# EAGLE schematic 10MHzRefOsc_3V0 (EAGLE 7.2.0), part 2 of 2
## Sheet 25 of 28: Socket_5
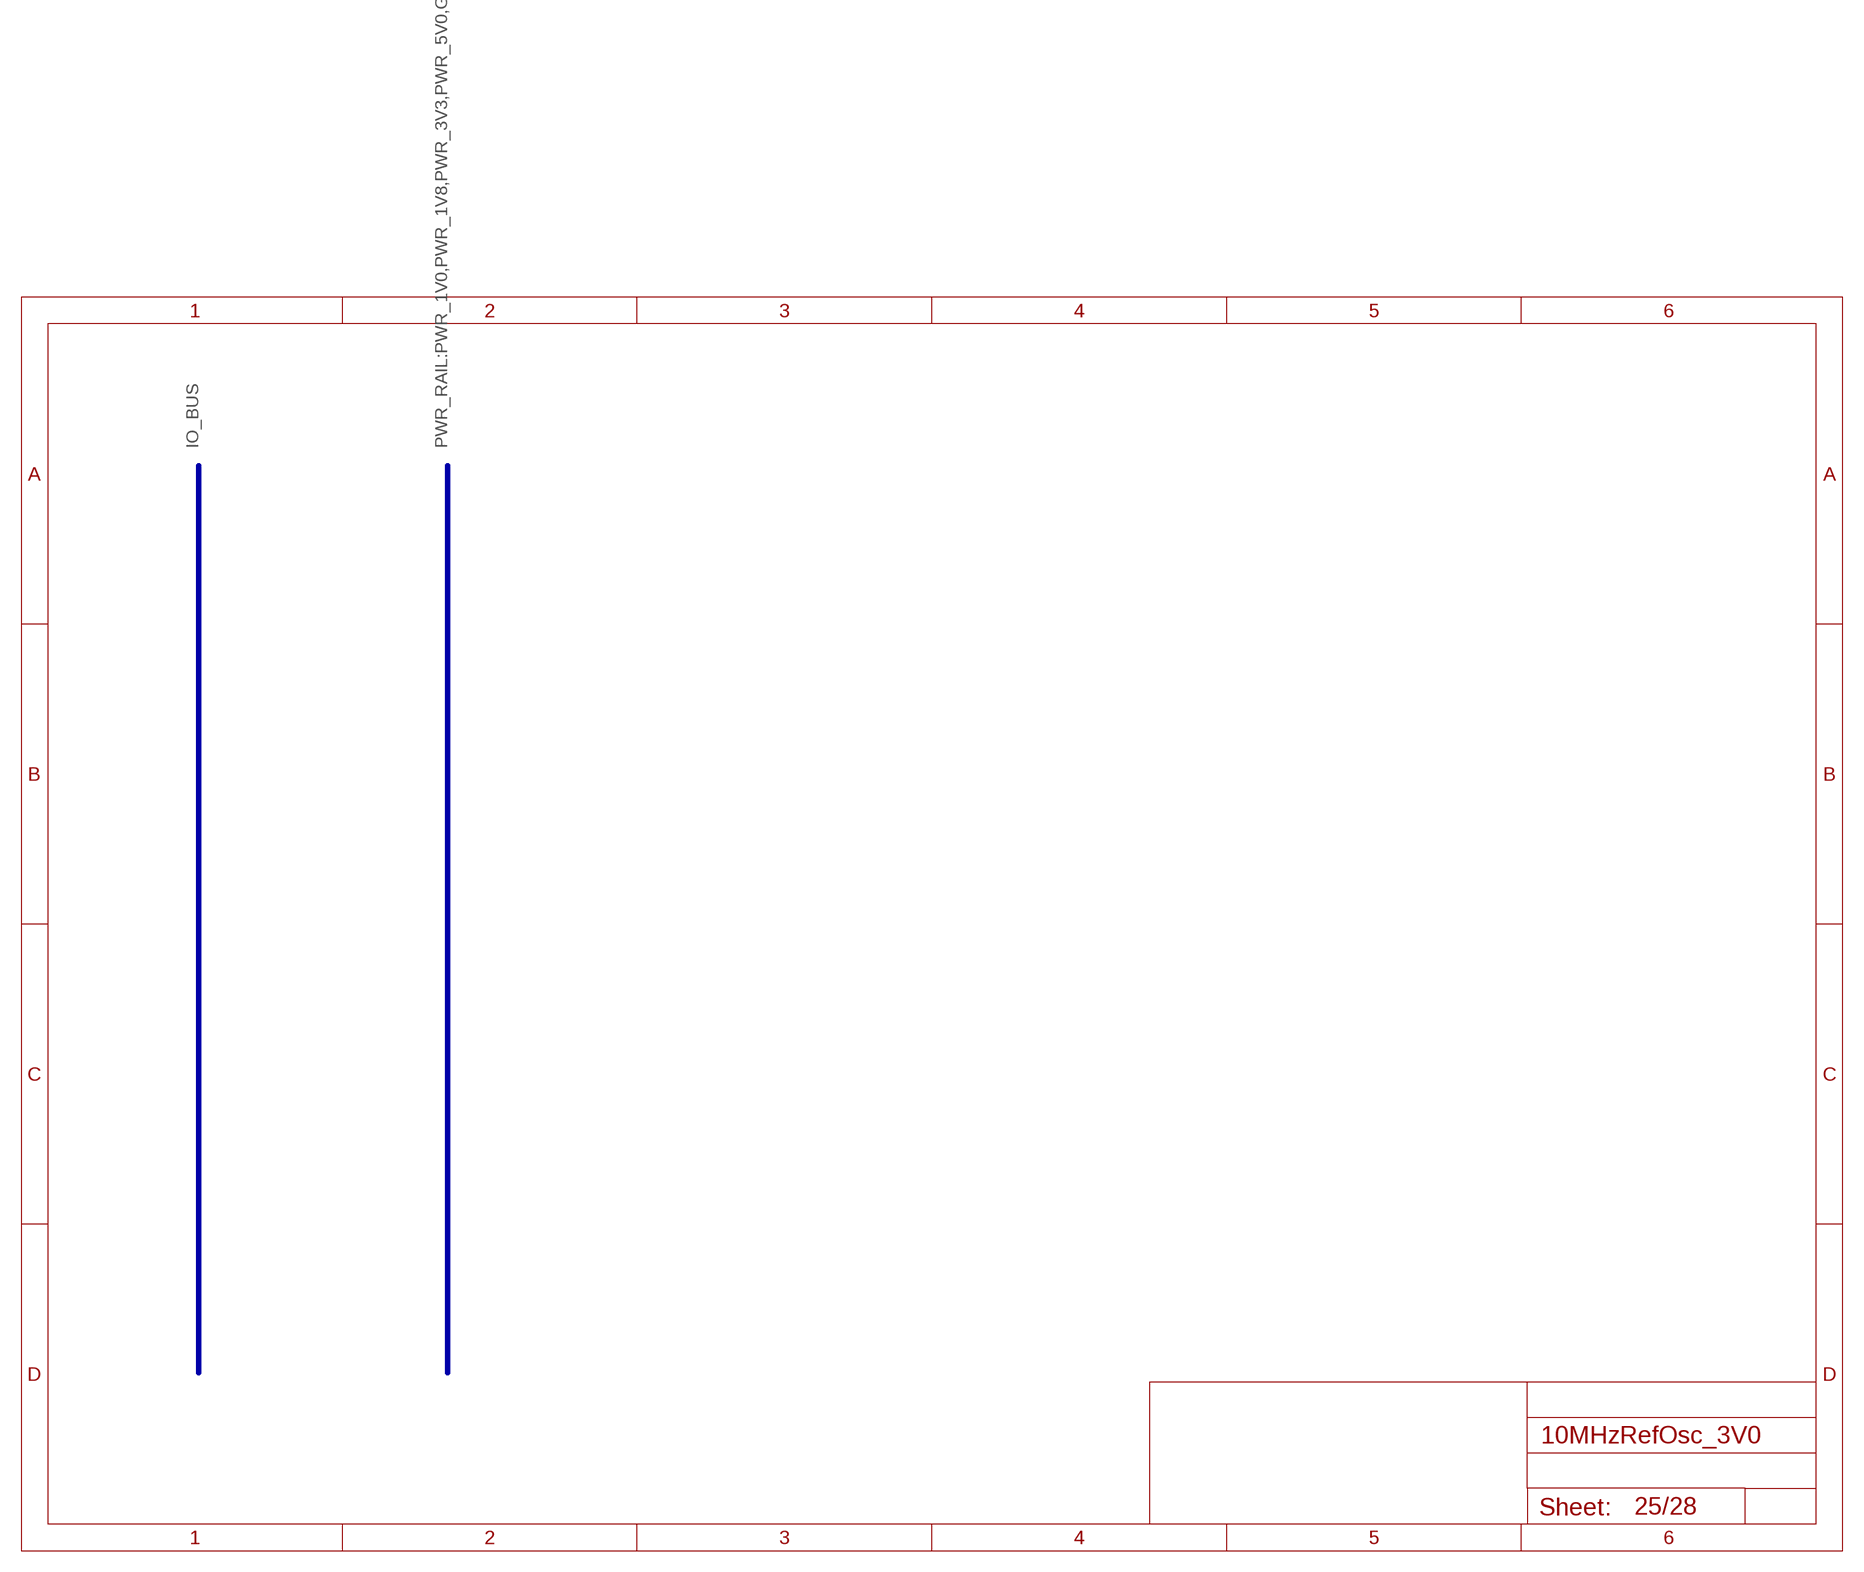
[diagram p24: schematic, sheet 25]

### Buses
IO_BUS
PWR_RAIL:PWR_1V0,PWR_1V8,PWR_3V3,PWR_5V0,GND

## Sheet 26 of 28: Socket_6
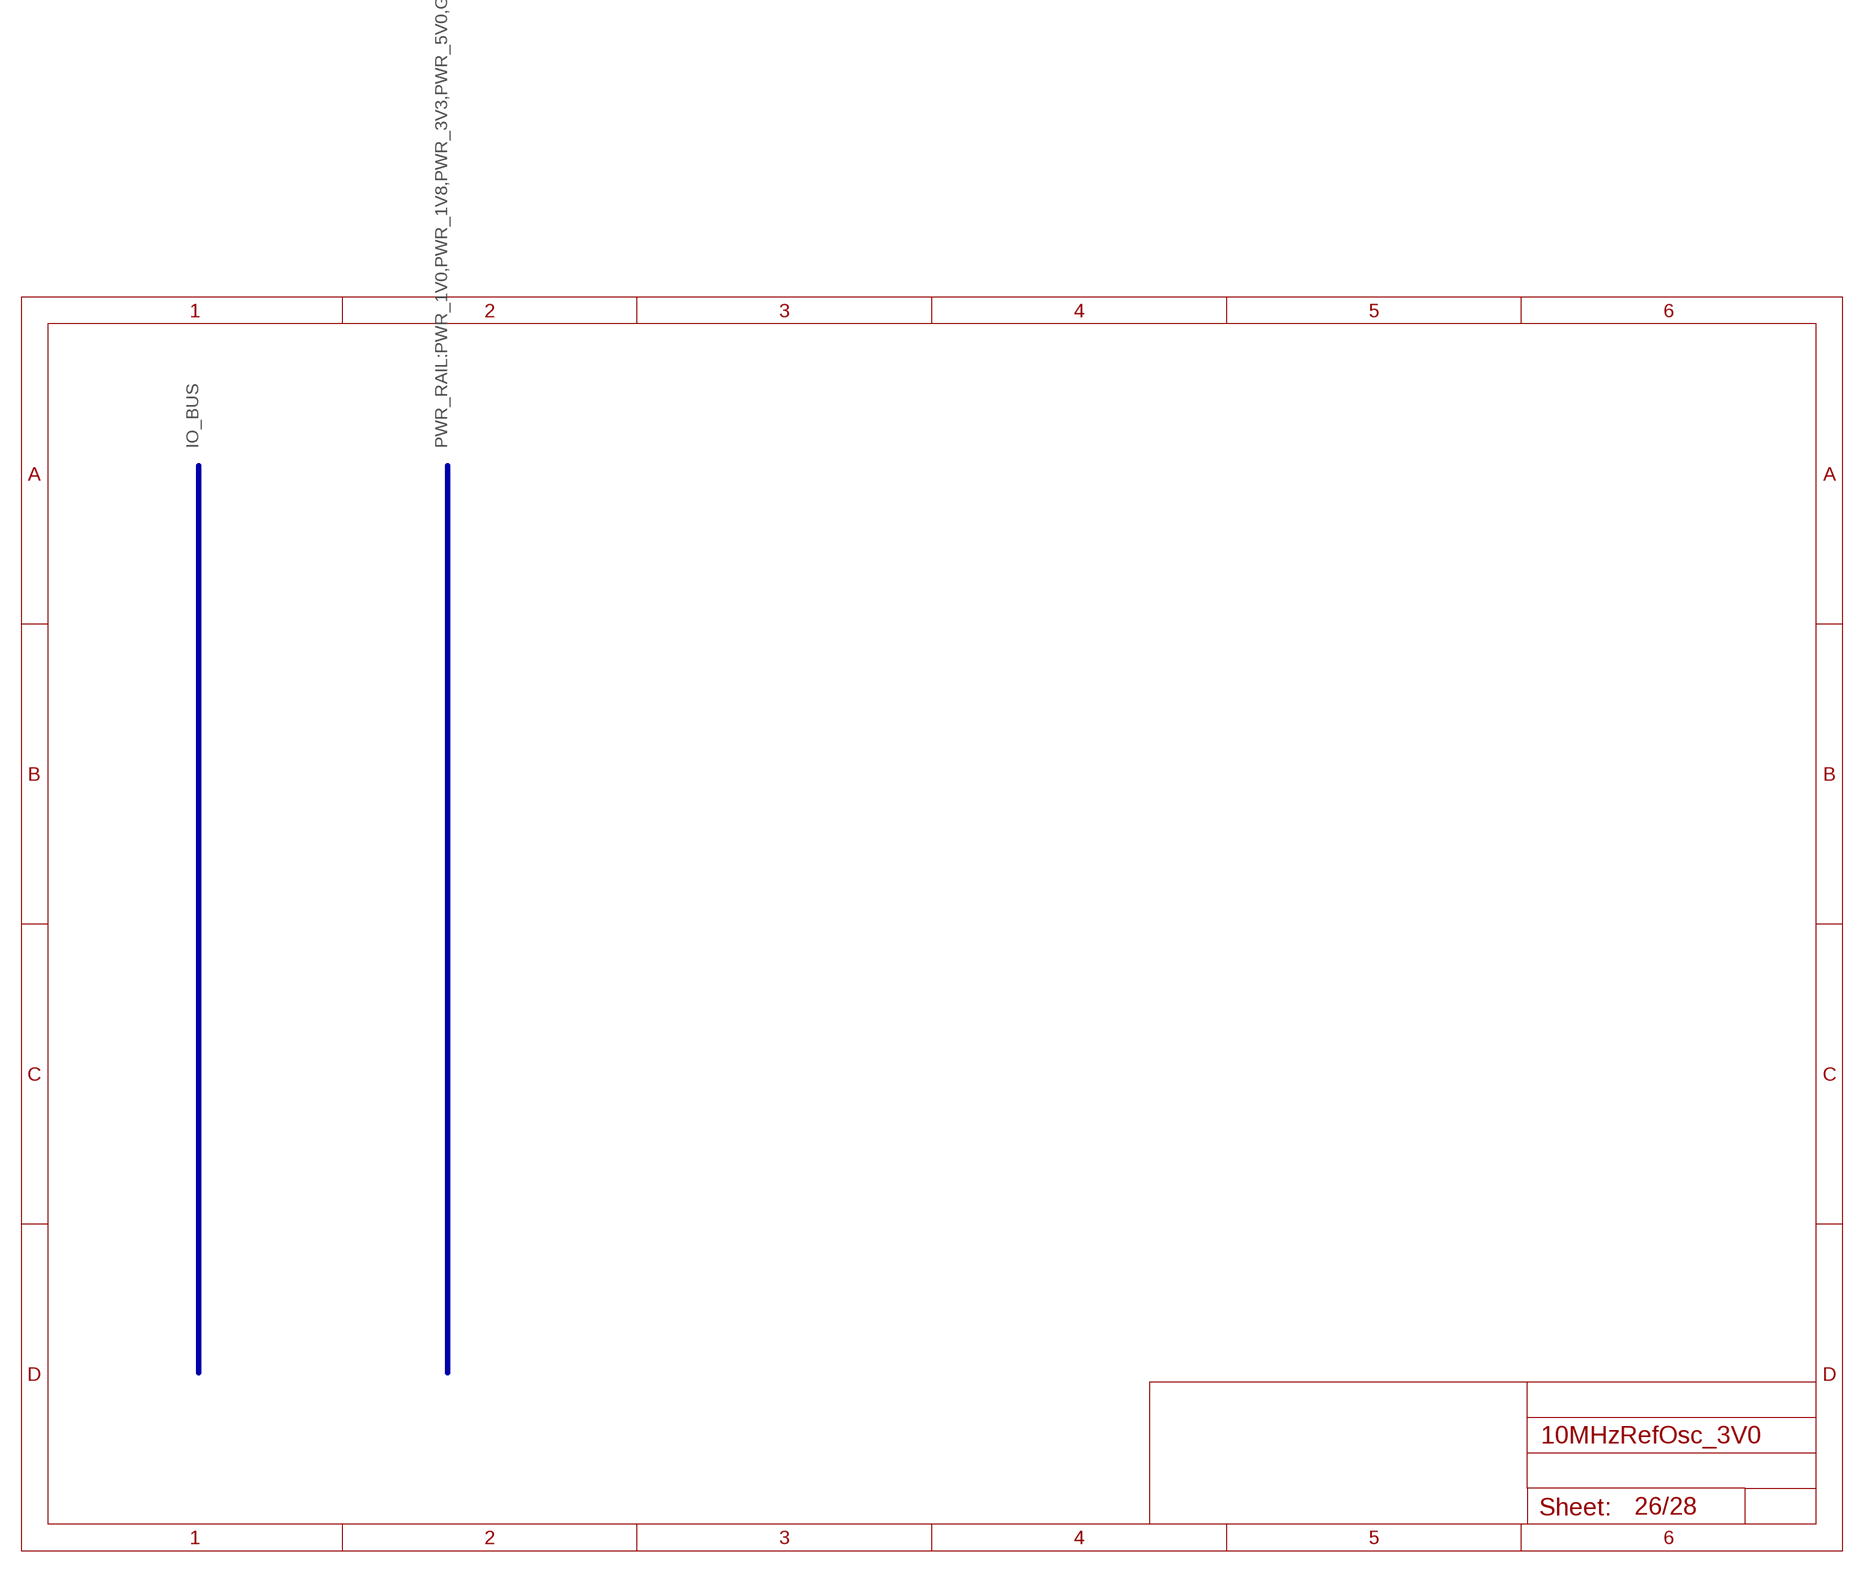
[diagram p25: schematic, sheet 26]

### Buses
IO_BUS
PWR_RAIL:PWR_1V0,PWR_1V8,PWR_3V3,PWR_5V0,GND

## Sheet 27 of 28: Socket_7
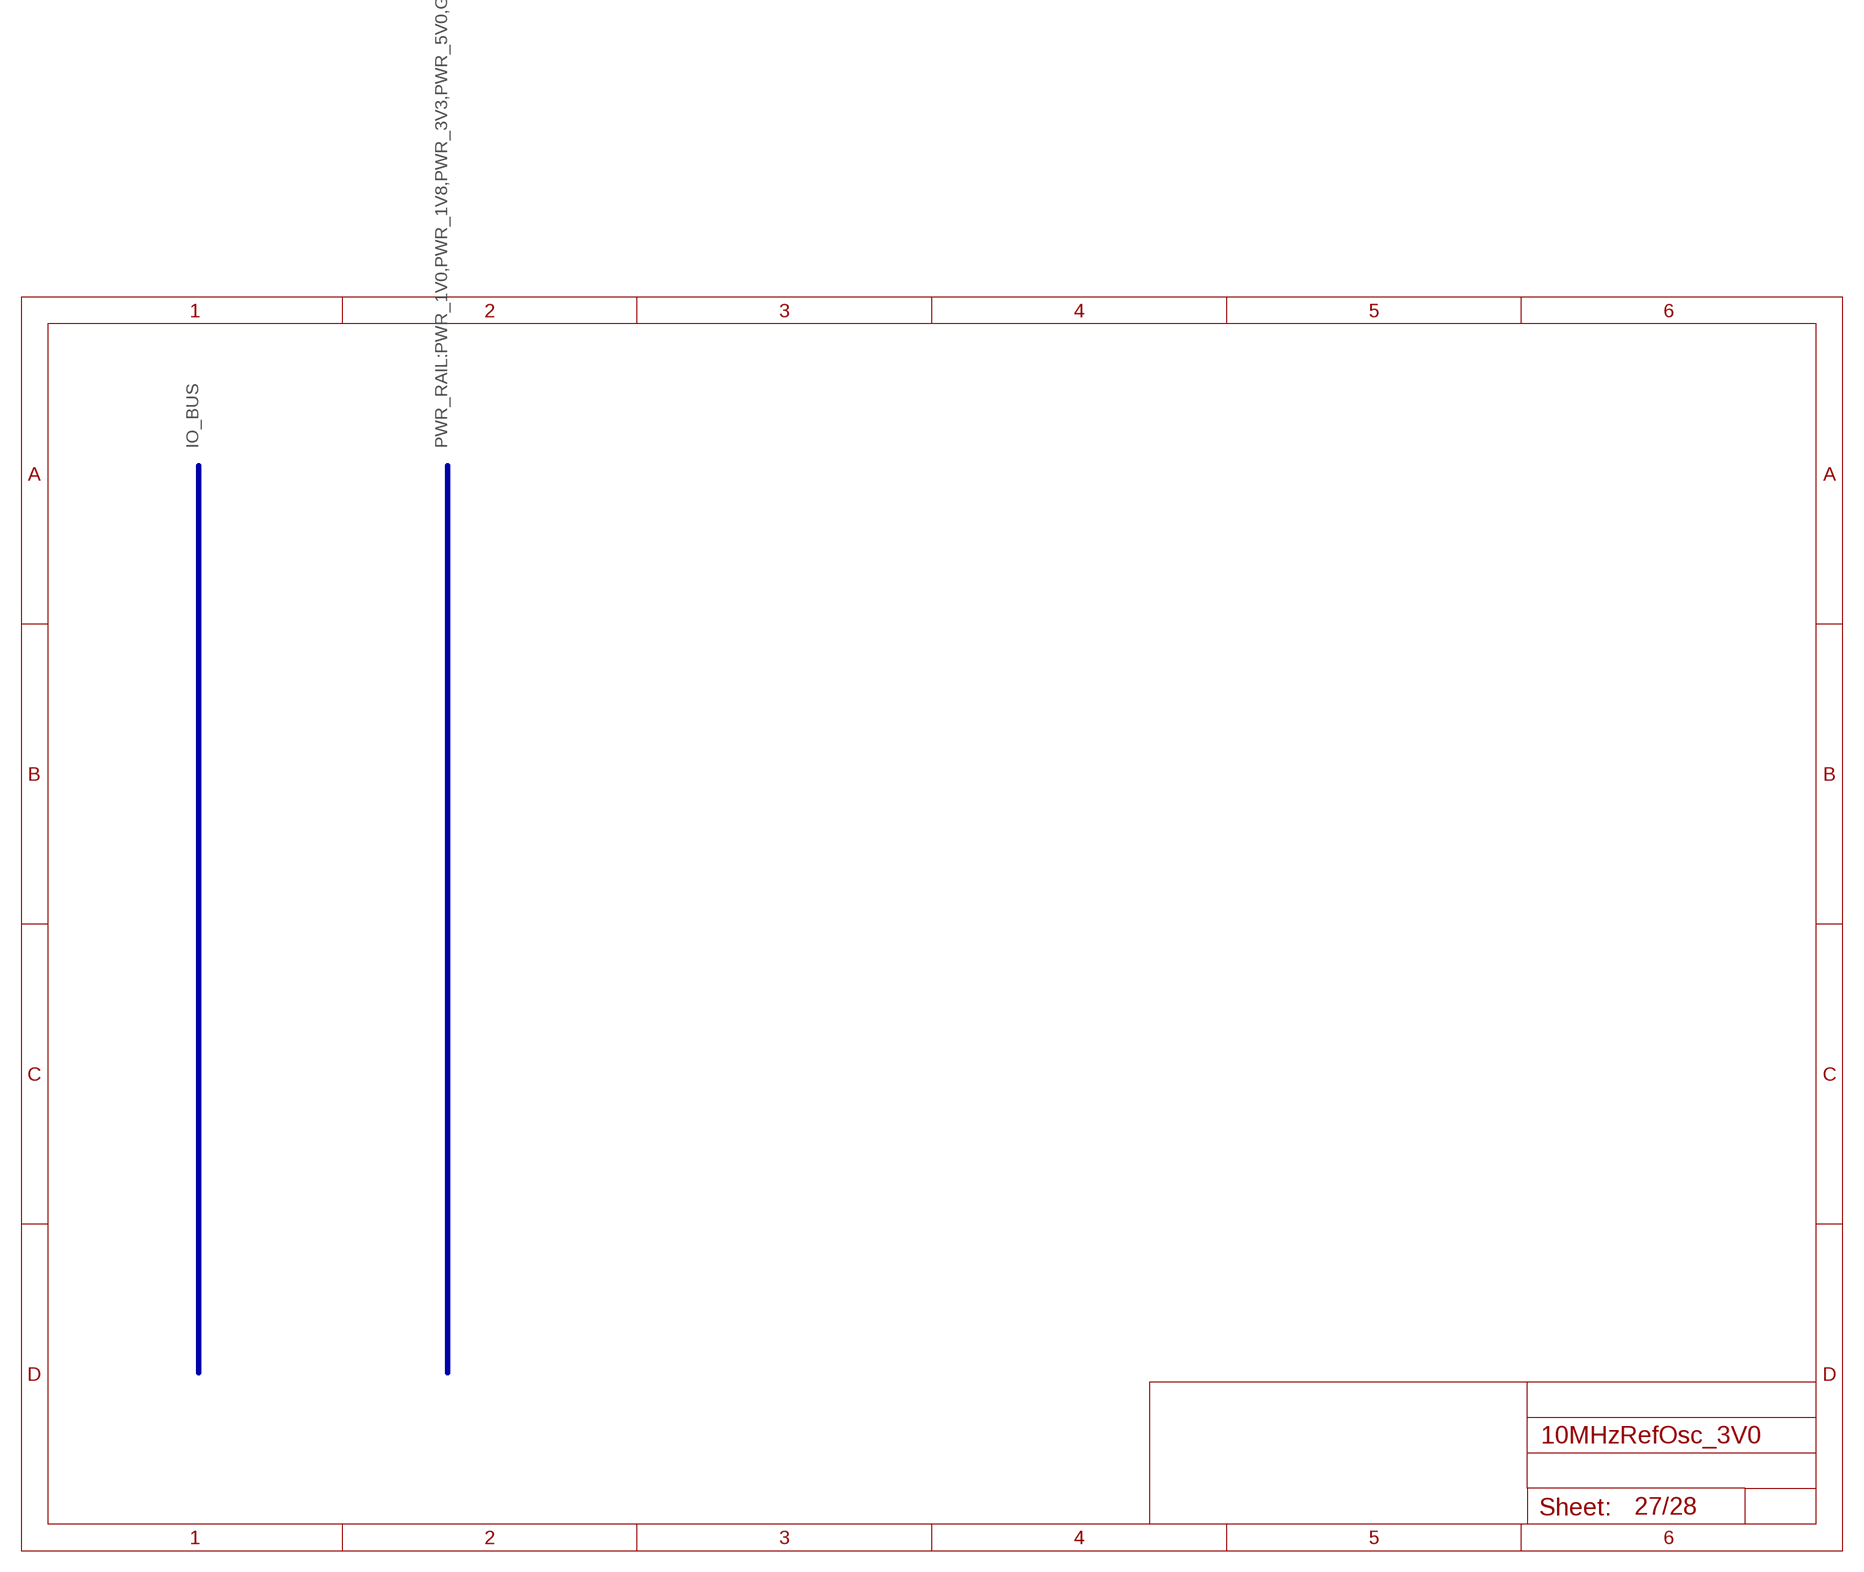
[diagram p26: schematic, sheet 27]

### Buses
IO_BUS
PWR_RAIL:PWR_1V0,PWR_1V8,PWR_3V3,PWR_5V0,GND

## Sheet 28 of 28: Spare parts
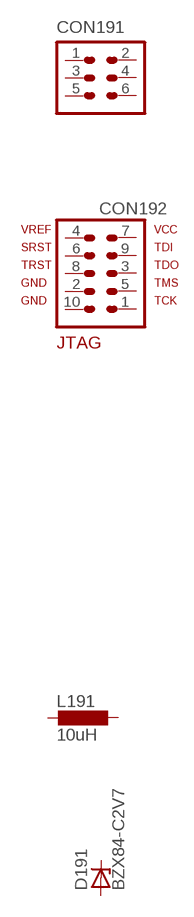
[diagram p27: schematic, sheet 28]

### Parts
CON191  HEADER-2X3SMD  [2X03SMD]
CON192  AVR-JTAG-10SMD  [2X5SMD]
D191  BZX84-C2V7  BZX84CSMD  [TO236]
L191  10uH  L-EUL1812  [L1812]
Unconnected: CON191.1 CON191.2 CON191.3 CON191.4 CON191.5 CON191.6 CON192.1 CON192.2 CON192.3 CON192.4 CON192.5 CON192.6 CON192.7 CON192.8 CON192.9 CON192.10 D191.A D191.C L191.1 L191.2

## Library data of the parts
C031 C041 C051-C057 C062-C067 C071-C073 C082-C087 C091 C092 C142 C1001-C1006 C1011 C1012 C1021-C1026 = rcl:C-EU: CAPACITOR, European symbol
C141 C151 = rcl:CPOL-EU: POLARIZED CAPACITOR, European symbol
C152 = df4iah:C-EU: CAPACITOR, European symbol
CON141 = df4iah:TYCO-AMP_USB: TYCO-AMP USB-Connectors From Catalog 7-1773422-0 Issued 03-06; MF: TYCO-AMP; MPN: 1734346; OC_FARNELL: 1321918
CON151 = df4iah_connector:HEADER-2X5: Header 2X5 2.54mm ISP, JTAG, ...
CON181 CON183-CON186 = df4iah:MCX-J-P-X-RA-SM1: FEMALE SMA CONNECTOR Radiall
CON182 = df4iah:MOLEX_BNC-JACK-50R_SD-73100-0105: MOLEX BNC-Jack 50 Ohm SD-73100-0102; MF: MOLEX; MPN: SD-73100-0105; OC_FARNELL: 1909203; OC_NEWARK: -
CON191 = df4iah:HEADER-2X3: Header 2X3 2.54mm ISP, ...
CON192 = df4iah:AVR-JTAG-10: AVR JTAG Debug/Programming Header
D031 D141 D142 D191 = diode:BZX84CSMD: Z DIODE
D151 = diode:ZENER-DIODE: Z-Diode
H191-H194 = holes:MOUNT-PAD-ROUND: MOUNTING PAD, round
L191 = rcl:L-EU: INDUCTOR, European symbol
R10 R021 R031 R041 R042 R051 R061 R071 R081 R091 R101-R105 R141-R144 R151 R152 RP141 RP151 = rcl:R-EU_: RESISTOR, European symbol
U1 = df4iah_fpga:XC7A35TFTG256: Xilinx FPGA: XC7A100TFTG256
U031 = df4iah:CFPT-141: TCXO, 3.0V; MF: IQD-FREQUENCY-PRODUCTS; MPN: LFTVXO022175; OC_FARNELL: 1100745; OC_NEWARK: -
U151 = df4iah_gps:GLOBALTOP-FIREFLY1-GMM-G3: GlobalTop FireFly 1 (Gmm-g3) gtop-tech.com GNSS Receiver Module based on MediaTek MT3333 data entry: 2015-03-17 by DF4IAH.

## Net classes
1 PWR_LOW: width 0.254 mm
2 PWR_MED: width 0.305 mm
3 PWR_HI: width 0.381 mm
4 PAIR_50R: width 2.819 mm, clearance 5.08 mm
5 PAIR_100R: width 1.143 mm, clearance 3.81 mm
6 CLK: clearance 1.27 mm